# Altium project PCB_Project.PrjPcb
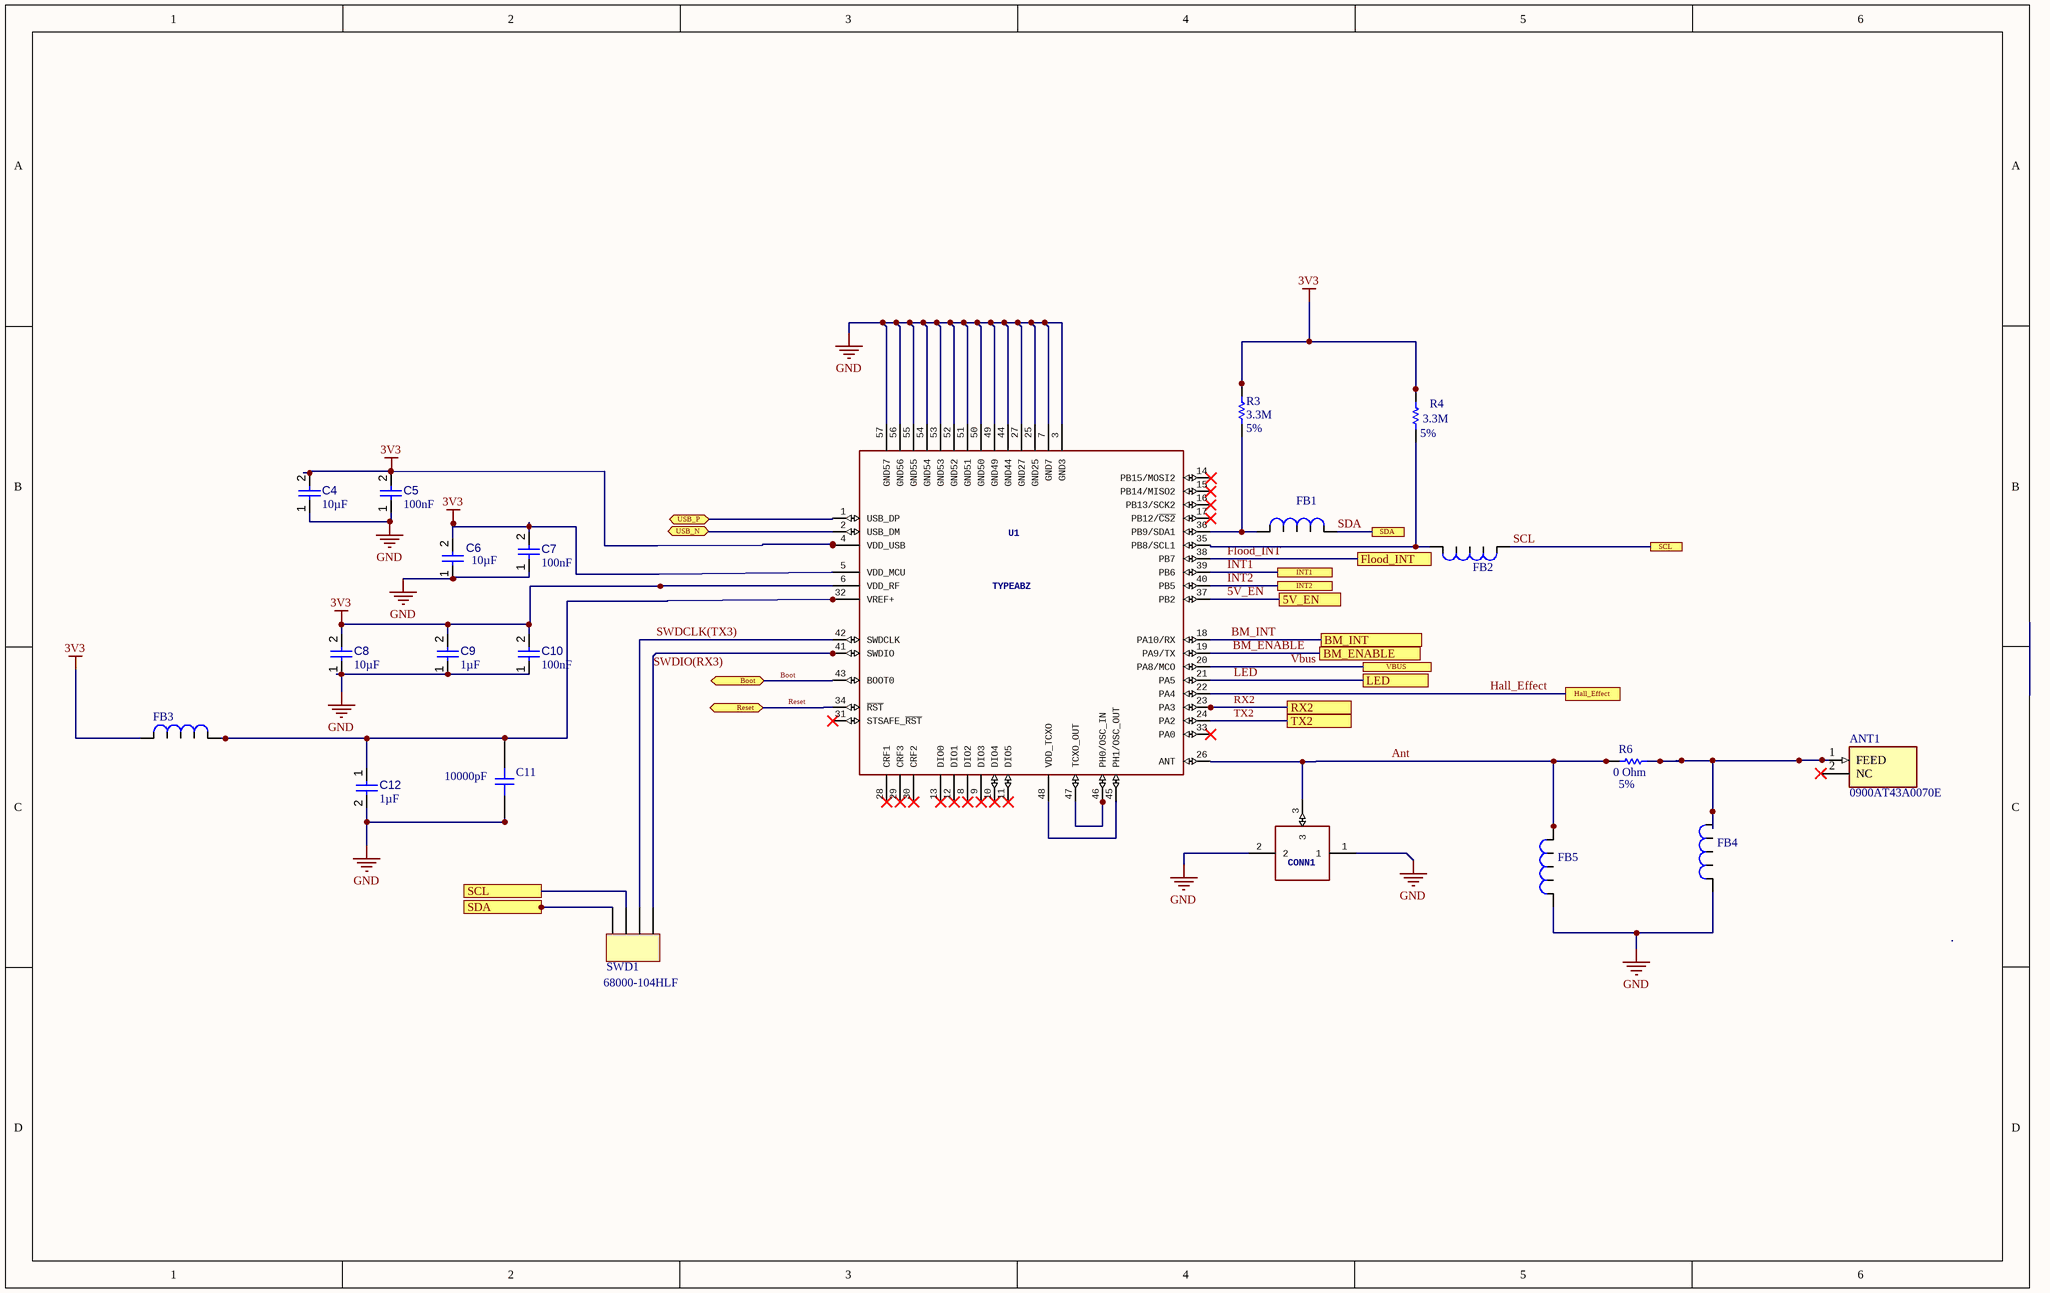
[diagram p0: [1]MCU.SchDoc]
8 sheets, 58 parts. Net scope: flat (ports and power ports of the same name join across sheets).
Board file: PCB_PROJECT.PcbDoc
Sheets:
  [1]MCU.SchDoc
  [2]Battery.SchDoc
  [3]USB.SchDoc
  [4]Button.SchDoc
  [5] Sensors.SchDoc
  [6]3-axis-accelerometer.SchDoc
  [7]Halleffec.SchDoc
  [8]O2-Flood.SchDoc

## Sheet [1]MCU.SchDoc
size B

### Parts
ANT1  0900AT43A0070E  [ANTC7020X90N]
C4  value 10µF  [CAPC0603(1608)100_L]  (hidden comment: Capacitor 10µF +/-20% 10V 0603)
C5  value 100nF  [CAPC1608X90X40ML10T20]  (hidden comment: Capacitor 100 nF +/-10% 50 V 0603)
C6  value 10µF  [CAPC0603(1608)100_L]  (hidden comment: Capacitor 10µF +/-20% 10V 0603)
C7  value 100nF  [CAPC1608X90X40ML10T20]  (hidden comment: Capacitor 100 nF +/-10% 50 V 0603)
C8  value 10µF  [CAPC0603(1608)100_L]  (hidden comment: Capacitor 10µF +/-20% 10V 0603)
C9  value 1µF  [CAPC1608X90X40ML10T20]  (hidden comment: Capacitor 1 uF +/- 10% 25 V 0603)
C10  value 100nF  [CAPC1608X90X40ML10T20]  (hidden comment: Capacitor 100 nF +/-10% 50 V 0603)
C11  10000PF  [CAPC0603]
C12  value 1µF  [CAPC1608X90X40ML10T20]  (hidden comment: Capacitor 1 uF +/- 10% 25 V 0603)
CONN1  U.FL-R-SMT-1  [U.FL-R-SMT-1]  (value not drawn)
FB1  BLM18AG102SN1D  [Ferrite Bead]  (value not drawn)
FB2  BLM18AG102SN1D  [Ferrite Bead]  (value not drawn)
FB3  BLM18AG102SN1D  [Ferrite Bead]  (value not drawn)
FB4  BLM18AG102SN1D  [Ferrite Bead]  (value not drawn)
FB5  BLM18AG102SN1D  [Ferrite Bead]  (value not drawn)
R3  value 3.3M  Tolerance: 5%  [RES 0603]  (hidden comment: RES 3.3M 5% 0.1W [0603])
R4  value 3.3M  Tolerance: 5%  [RES 0603]  (hidden comment: RES 3.3M 5% 0.1W [0603])
R6  value 0 Ohm  Tolerance: 5%  [RES 0603]  (hidden comment: RES 0 Ohm 5% 0.1W [0603])
SWD1  68000-104HLF  [4POS_HEADER]
U1  TYPEABZ  [CMWX1ZZABZ]

### Ports
5V_EN, BM_ENABLE, BM_INT, Boot (bidir), Flood_INT, Hall_Effect, INT1, INT2, LED, Reset (bidir), RX2, SCL, SDA, TX2, USB_N (bidir), USB_P (bidir), VBUS

### Nets
3V3: C4.2 C5.2 C6.2 C7.2 C8.2 C9.2 C10.2 FB3.2 R3.2 R4.2 U1.4(VDD_USB) U1.5(VDD_MCU) U1.6(VDD_RF)
GND: C4.1 C5.1 C6.1 C7.1 C8.1 C9.1 C10.1 C11.1 C12.2 CONN1.1 CONN1.2 FB4.2 FB5.2 U1.3(GND3) U1.7(GND7) U1.25(GND25) U1.27(GND27) U1.44(GND44) U1.49(GND49) U1.50(GND50) U1.51(GND51) U1.52(GND52) U1.53(GND53) U1.54(GND54) U1.55(GND55) U1.56(GND56) U1.57(GND57)
5V_EN: U1.37(PB2) ; port 5V_EN
Ant: CONN1.3 FB5.1 R6.1 U1.26(ANT)
BM_ENABLE: U1.19(PA9/TX) ; port BM_ENABLE
BM_INT: U1.18(PA10/RX) ; port BM_INT
Boot: U1.43(BOOT0) ; port Boot
Flood_INT: U1.38(PB7) ; port Flood_INT
Hall_Effect: U1.22(PA4) ; port Hall_Effect
INT1: U1.39(PB6) ; port INT1
INT2: U1.40(PB5) ; port INT2
LED: U1.21(PA5) ; port LED
Reset: U1.34(~{RST}) ; port Reset
RX2: U1.23(PA3) ; port RX2
SCL: FB2.2 SWD1.2 ; port SCL
SDA: FB1.2 SWD1.1 ; port SDA
SWDCLK(TX3): SWD1.3 U1.42(SWDCLK)
SWDIO(RX3): SWD1.4 U1.41(SWDIO)
TX2: U1.24(PA2) ; port TX2
USB_N: U1.2(USB_DM) ; port USB_N
USB_P: U1.1(USB_DP) ; port USB_P
Vbus: U1.20(PA8/MCO) ; port VBUS
NetANT1_1: ANT1.1(FEED) FB4.1 R6.2
NetC11_2: C11.2 C12.1 FB3.1 U1.32(VREF+)
NetFB1_1: FB1.1 R3.1 U1.36(PB9/SDA1)
NetFB2_1: FB2.1 R4.1 U1.35(PB8/SCL1)
NetU1_45: U1.45(PH1/OSC_OUT) U1.48(VDD_TCXO)
NetU1_46: U1.46(PH0/OSC_IN) U1.47(TCXO_OUT)

Not connected (* = marked no-connect by the designer): ANT1 2(NC); U1 8(DIO2)* 9(DIO3)* 10(DIO4)* 11(DIO5)* 12(DIO1)* 13(DIO0)* 14(PB15/MOSI2) 15(PB14/MISO2)* 16(PB13/SCK2)* 17(PB12/~{CS2})* 28(CRF1)* 29(CRF3)* 30(CRF2)* 31(STSAFE_~{RST})* 33(PA0)*

### Notes on the sheet
- Title
- Size:
- Date:
- A3
- Number:
- Time:
- Revision:
- Sheet
- of
- File:

### Library data of the parts
ANT1 = 0900AT43A0070E: Antenna; Manufacturer_Name: JOHANSON TECHNOLOGY; Datasheet Link: https://www.johansontechnology.com/datasheets/0900AT43A0070/0900AT43A0070.pdf; Height: 0.9mm; Manufacturer_Part_Number: 0900AT43A0070E
C4 C6 C8 = CMP-001-00075-2: Chip Capacitor, 10µF +/-20%, 10V, 0603, Thickness 1 mm; Tolerance: 10%; Mounting Technology: SMT; Pins: 2; Min Operating Temperature: -55°C; Case/Package: 0402; Max Operating Temperature: 85°C; Voltage Rating: 10V
C5 C7 C10 = CMP-001-00017-4: Chip Capacitor, 100 nF, +/- 10%, 50 V, 0603 (1608 Metric); Capacitor Type: Ceramic; Voltage Rating: 50V; RoHS Compliant: True; Max Operating Temperature: 125°C; Pins: 2; Mounting Technology: SM; Min Operating Temperature: -55°C; Tolerance: 10%; Case/Package: 0603
C9 C12 = CMP-001-00005-4: Chip Capacitor, 1 uF, +/- 10%, 25 V, 0603 (1608 Metric); Voltage Rating: 25V; Capacitor Type: Ceramic; Min Operating Temperature: -55°C; Tolerance: 10%; Max Operating Temperature: 125°C; Case/Package: 0603; RoHS Compliant: True; Mounting Technology: SM; Pins: 2
C11 = GRM188R71H103KA01D: CAP CER 10000PF 50V X7R 0603; Manufacturer: Murata Electronics North America; Tolerance: ±10%; Supplier 1: Digi-Key; Manufacturer Part Number: GRM188R71H103KA01D; RoHS: RoHS Compliant; Category: Capacitors; Stock 1: 5417714; Pricing 1: 1=0.14, 10=0.031, 100=0.0135, 500=0.00966, 1000=0.00758 (CAD); Packaging: Cut Tape (CT); Part Status: Active; Capacitance: 10000pF; Voltage - Rated: 50V; Temperature Coefficient: X7R; Operating Temperature: -55°C ~ 125°C; Features: -; Ratings: -; Applications: General Purpose; Mounting Type: Surface Mount, MLCC; Package / Case: 0603 (1608 Metric); Size / Dimension: 0.063" L x 0.031" W (1.60mm x 0.80mm); Height - Seated (Max): -; Thickness (Max): 0.035" (0.90mm); Lead Spacing: -; Lead Style: -; ComponentLink1URL: http://www.murata.com/~/media/webrenewal/support/library/catalog/products/capacitor/mlcc/c02e.ashx; ComponentLink1Description: http://www.murata.com/~/media/webrenewal/support/library/catalog/products/capacitor/mlcc/c02e.ashx; Supplier Part Number 1: 490-1512-1-ND
CONN1 = U.FL-R-SMT-1: GateName_1: G$1; SymbolName_1: U.FL-R-SMT-1; LibraryName: Kris; DeviceSetName: U.FL-R-SMT-1
FB1-FB5 = Ferrite Bead: Ferrite Bead 1KOhm @100MHz; Datasheet: https://www.murata.com/en-us/products/productdata/8796738650142/ENFA0003.pdf?src-supplier=Digi-Key; Supplier 1: Mouser; Supplier Part Number 1: 81-BLM11A102S; PN: BLM18AG102SN1D
R3 R4 = RES 3.3M 1% 0.1W [0603]: PN: CRCW06033M30FKEA; Supplier 1: Digi-Key; Supplier Part Number 1: 541-3.30MHCT-ND
R6 = RES 0 Ohm [0603]: PN: ERJ-3GEY0R00V; Supplier 1: Mouser; Supplier Part Number 1: 667-ERJ-3GEY0R00V; Datasheet: http://industrial.panasonic.com/cdbs/www-data/pdf/RDA0000/AOA0000C301.pdf?src-supplier=Farnell
SWD1 = 68000-104HLF: 4 Positions Header, Unshrouded Connector 0.100" (2.54mm) Through Hole Gold or Gold, GXT™; Manufacturer 1: Amphenol FCI; Number of Positions: 4; Gender: Male; Connector Type: Male Pin; Voltage Rating: 1.5kV; Current Rating: 3A; Insulation Resistance: 5GR; Mating Post Length: 5.84mm; Mount: Through Hole; Colour: Black; Housing Colour: Black; Housing Material: Thermoplastic; Contact Plating: Nickel,Gold,GXT; Contact Material: Bronze; Min Operating Temperature: -65°C; Max Operating Temperature: 125°C; Number of Rows: 1; Packaging: Bulk; Package Quantity: 100; Termination: Solder; Number of Contacts: 4; Orientation: Straight; Max Voltage Rating (AC): 1.5kV; Contact Gender: Male; Length: 10.16mm; Pitch: 2.54mm; Depth: 2.41mm; Termination Post Length: 2.41mm; Contact Mating Length: 0.23inch; Radiation Hardening: No; REACH SVHC: No SVHC; Flammability Rating: UL94 V-0; ComponentLink1URL: https://datasheet.ciiva.com/16726/68000-16726213.pdf; ComponentLink1Description: https://datasheet.ciiva.com/16726/68000-16726213.pdf; ComponentLink2URL: https://datasheet.ciiva.com/10149/68000-10149830.pdf; ComponentLink2Description: https://datasheet.ciiva.com/10149/68000-10149830.pdf; ComponentLink3URL: https://datasheet.ciiva.com/46395/1914865-46395854.pdf; ComponentLink3Description: https://datasheet.ciiva.com/46395/1914865-46395854.pdf; ComponentLink4URL: https://datasheet.ciiva.com/728/68000-728879.pdf; ComponentLink4Description: https://datasheet.ciiva.com/728/68000-728879.pdf; Description 1: 4 Positions Header, Unshrouded Connector 0.100" (2.54mm) Through Hole Gold or Gold, GXT™; Manufacturer Part Number 1: 68000-104HLF; Pricing 1: 1=0.33, 10=0.316, 100=0.2212, 500=0.18964, 1000=0.15803, 5000=0.13545, 10000=0.12642 (USD); Stock 1: 10785; Supplier 1: Digi-Key; Supplier Part Number 1: 609-3248-ND
U1 = TYPEABZ: CMWX1ZZABZ-078; GateName_1: G$1; SymbolName_1: TYPEABZ; DeviceSetName: TYPEABZ

## Sheet [2]Battery.SchDoc
size B
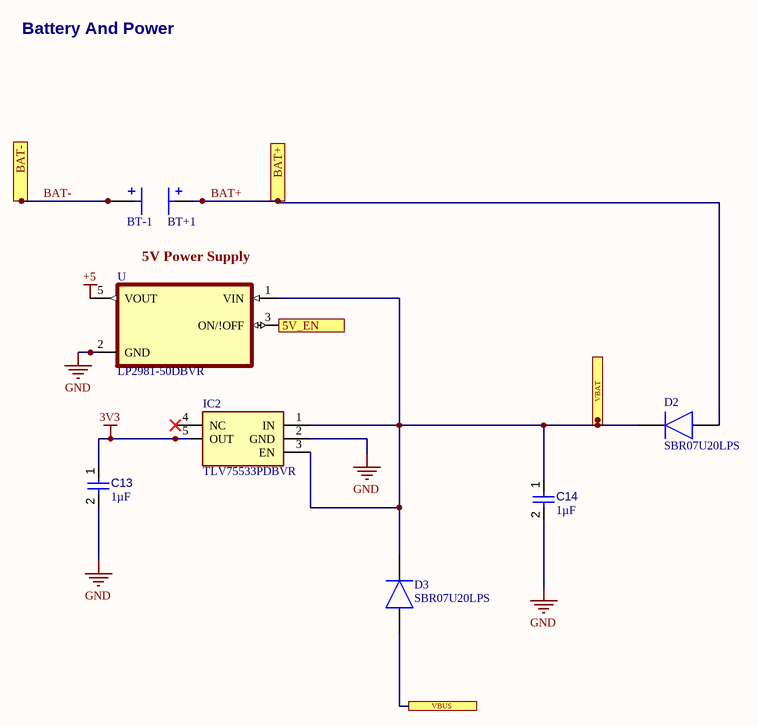
[diagram p1: [2]Battery.SchDoc]

### Parts
BT+1  BATTERY CONTACT CLIP A/AA PC PIN  [BAT_BK-82]  (value not drawn)
BT-1  BATTERY CONTACT CLIP A/AA PC PIN  [BAT_BK-82]  (value not drawn)
C13  value 1µF  [CAPC1608X90X40ML10T20]  (hidden comment: Capacitor 1 uF +/- 10% 25 V 0603)
C14  value 1µF  [CAPC1608X90X40ML10T20]  (hidden comment: Capacitor 1 uF +/- 10% 25 V 0603)
D2  SBR07U20LPS  [CDBQR70HF]
D3  SBR07U20LPS  [CDBQR70HF]
IC2  TLV75533PDBVR  [SOT95P280X145-5N]
U  LP2981-50DBVR  [SOT95P280X145-5N]

### Ports
5V_EN, BAT+, BAT-, VBAT, VBUS

### Nets
3V3: C13.1 IC2.5(OUT)
+5: U.5(VOUT)
GND: C13.2 C14.2 IC2.2(GND) U.2(GND)
5V_EN: U.3(ON/!OFF) ; port 5V_EN
BAT+: BT+1.S1(POS) BT+1.S2(POS) D2.2(A) ; port BAT+
BAT-: BT-1.S1(POS) BT-1.S2(POS) ; port BAT-
Vbus: D3.2(A) ; port VBUS
NetC14_1: C14.1 D2.1(K) D3.1(K) IC2.1(IN) IC2.3(EN) U.1(VIN) ; port VBAT

Not connected (* = marked no-connect by the designer): IC2 4(NC)*

### Notes on the sheet
- Battery And Power
- 5V Power Supply
- Title
- Size:
- Date:
- A3
- Number:
- Time:
- Revision:
- Sheet
- of
- File:

### Library data of the parts
BT+1 BT-1 = BK-82: Battery Contact Clip A, AA 1 Cell PC Pin; MF PN: 92 -Keystone Electronics; DK PN: 36-92-ND; Value: *; Availability: Unavailable; Package: None; Price: None
C13 C14 = CMP-001-00005-4: as C9 on sheet [1]MCU; Min Operating Temperature: -55°C; Tolerance: 10%; Max Operating Temperature: 125°C; Case/Package: 0603; RoHS Compliant: True; Mounting Technology: SM; Pins: 2
D2 D3 = CDSQR4148-HF_1: Diode; Manufacturer_Name: Comchip Technology; Datasheet Link: http://www.comchiptech.com/admin/files/product/CDSQR4148-HF-RevC213424.pdf; Height: 0mm; Manufacturer_Part_Number: CDSQR4148-HF; Arrow Part Number: CDSQR4148-HF; Arrow Price/Stock: https://www.arrow.com/en/products/cdsqr4148-hf/comchip-technology; Mouser Part Number: 750-CDSQR4148-HF; Mouser Price/Stock: https://www.mouser.co.uk/ProductDetail/Comchip-Technology/CDSQR4148-HF?qs=2qJf6qQ4IOKNV97fk6Xvow%3D%3D; ComponentLink1Description: SBR07U20LPS; ComponentLink1URL: https://www.diodes.com/assets/Datasheets/SBR07U20LPS.pdf
IC2 = TLV75533PDBVR: Integrated Circuit; Manufacturer_Name: Texas Instruments; Datasheet Link: http://www.ti.com/lit/gpn/tlv755p; Height: 1.45mm; Manufacturer_Part_Number: TLV75533PDBVR; Mouser Part Number: 595-TLV75533PDBVR; Mouser Price/Stock: https://www.mouser.co.uk/ProductDetail/Texas-Instruments/TLV75533PDBVR?qs=55YtniHzbhAKEwqeO2xJXQ%3D%3D; Arrow Part Number: TLV75533PDBVR; Arrow Price/Stock: https://www.arrow.com/en/products/tlv75533pdbvr/texas-instruments
U = LP2981-50DBVR: 100-mA, 16-V, low-dropout voltage regulator with enable 5-SOT-23 -40 to 125; MF: Texas Instruments; Package: SOT-23-5 Texas Instruments; SnapEDA_Link: https://www.snapeda.com/parts/LP2981-50DBVR/Texas%20Instruments/view-part/472200/?ref=snap; DigiKey-Purchase-URL: https://snapeda.com/shop?store=DigiKey&id=472200; MP: LP2981-50DBVR; Value: *; Arrow_Electronics-Purchase-URL: https://snapeda.com/shop?store=Arrow+Electronics&id=472200; Availability: Unavailable; Texas_Instruments-Purchase-URL: https://snapeda.com/shop?store=Texas+Instruments&id=472200; Price: None; Mouser-Purchase-URL: https://snapeda.com/shop?store=Mouser&id=472200

## Sheet [3]USB.SchDoc
size B
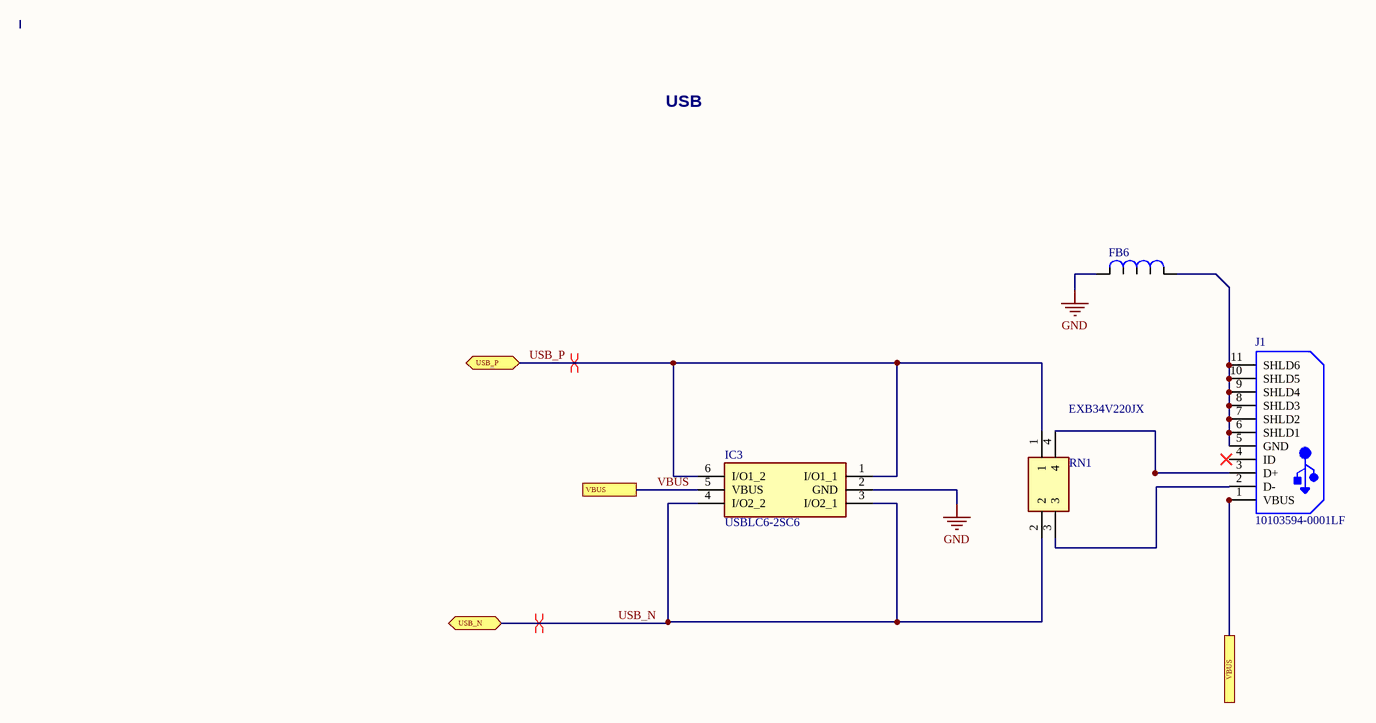
[diagram p2: [3]USB.SchDoc]

### Parts
FB6  BLM18AG102SN1D  [Ferrite Bead]  (value not drawn)
IC3  USBLC6-2SC6  [SOT95P280X145-6N]
J1  10103594-0001LF  [FCI-10103594-0001LF_V]
RN1  EXB34V220JX  [EXB34V103JV]

### Ports
USB_N (bidir), USB_P (bidir), VBUS

### Nets
GND: FB6.2 IC3.2(GND)
USB_N: IC3.3(I/O2_1) IC3.4(I/O2_2) RN1.2 ; port USB_N
USB_P: IC3.1(I/O1_1) IC3.6(I/O1_2) RN1.1 ; port USB_P
Vbus: IC3.5(VBUS) J1.1(VBUS) ; port VBUS
NetFB6_1: FB6.1 J1.5(GND) J1.6(SHLD1) J1.7(SHLD2) J1.8(SHLD3) J1.9(SHLD4) J1.10(SHLD5) J1.11(SHLD6)
NetJ1_2: J1.2(D-) RN1.3
NetJ1_3: J1.3(D+) RN1.4

Not connected (* = marked no-connect by the designer): J1 4(ID)

### Layout directives
differential pair; differential pair class USBDiffPair: USB_N, USB_P

### Notes on the sheet
- USB
- 8
- 7
- 6
- 5
- 4
- 3
- DWG. NO.
- REV.
- SHT.
- REVISION
- 2
- DESCRIPTION
- DATE
- 1
- APPROVED
- THIS DOCUMENT AND THE DATA DISCLOSED HEREIN OR HEREWITH IS THE PROPERTY OF ALTIUM LIMITED AND MAY BE FREELY DISTRIBUTED IN WHOLE. NO RIGHTS ARE RESERVED OR EXPRESS OR IMPLIED WARANTEE GIVEN.
- F
- E
- D
- C
- B
- A
- SCALE:
- A3
- SIZE
- CAGE CODE
- FILE NAME
- DWG NO.
- SHEET
- OF
- REV

### Library data of the parts
FB6 = Ferrite Bead: Ferrite Bead 1KOhm @100MHz; Datasheet: https://www.murata.com/en-us/products/productdata/8796738650142/ENFA0003.pdf?src-supplier=Digi-Key; Supplier 1: Mouser; Supplier Part Number 1: 81-BLM11A102S; PN: BLM18AG102SN1D
IC3 = USBLC6-2SC6: Integrated Circuit; Manufacturer_Name: STMicroelectronics; Datasheet Link: http://www.st.com/st-web-ui/static/active/en/resource/technical/document/datasheet/CD00050750.pdf; Height: 1.45mm; Manufacturer_Part_Number: USBLC6-2SC6; Mouser Part Number: 511-USBLC6-2SC6; Mouser Price/Stock: https://www.mouser.co.uk/ProductDetail/STMicroelectronics/USBLC6-2SC6/?qs=po45yt2pPpu%2FhNIlwQdTlg%3D%3D; Arrow Part Number: USBLC6-2SC6; Arrow Price/Stock: https://www.arrow.com/en/products/usblc6-2sc6/stmicroelectronics
J1 = CMP-002-00038-1: Micro USB 2.0 B Receptacle, 5 Position, Height 3.24 mm, -55 to 85 degC, RoHS, Tape and Reel; Manufacturer: FCI Electronics; Voltage Rating: 100V; Gender: Female; Current Rating: 1.8A; Min Operating Temperature: -55°C; Pins: 5; Contact Plating: Gold; Package Description: 5-Pin Surface Mount Device, Body 8.04 x 5.62 mm; RoHS Compliant: True; Lead Pitch: 0.65mm; Packaging: TapeandReel; Case/Package: FCI-10103594-0001LF; Manufacturer URL: http://portal.fciconnect.com/; Mounting Technology: SM; Datasheet Version: Rev. A, 06/2010; Connector Type: USB; Contact Material: Copper; Datasheet URL: http://portal.fciconnect.com/Comergent//fci/drawing/10103594.pdf; Max Operating Temperature: 85°C; Package Quantity: 1500; Package Reference: FCI-10103594-0001LF
RN1 = EXB34V330JV: Resistor Network; Manufacturer_Name: Panasonic; Datasheet Link: https://industrial.panasonic.com/cdbs/www-data/pdf/AOC0000/AOC0000C14.pdf; Height: 0.5mm; Manufacturer_Part_Number: EXB34V330JV; ComponentLink1Description: EXB24/34V; ComponentLink1URL: https://www.mouser.ca/datasheet/2/315/AOC0000C14-1108062.pdf

## Sheet [4]Button.SchDoc
size B
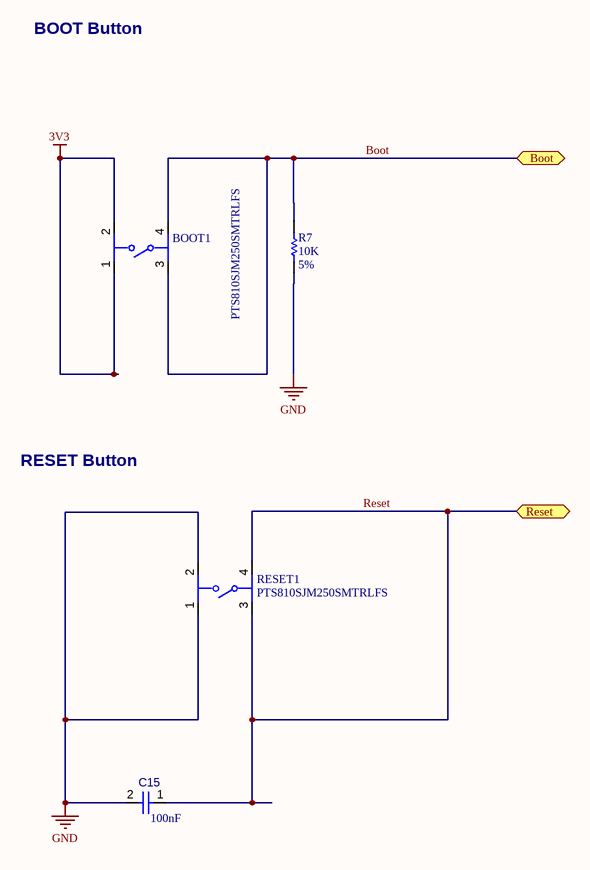
[diagram p3: [4]Button.SchDoc]

### Parts
BOOT1  PTS810SJM250SMTRLFS  [FP-PTS810SJM250SMTRLFS-MFG]
C15  value 100nF  [CAPC1608X90X40ML10T20]  (hidden comment: Capacitor 100 nF +/-10% 50 V 0603)
R7  value 10K  Tolerance: 5%  [RES 0603]  (hidden comment: RES 10K 5% 0.1W [0603])
RESET1  PTS810SJM250SMTRLFS  [FP-PTS810SJM250SMTRLFS-MFG]

### Ports
Boot (bidir), Reset (bidir)

### Nets
3V3: BOOT1.1 BOOT1.2
GND: C15.2 R7.1 RESET1.1 RESET1.2
Boot: BOOT1.3 BOOT1.4 R7.2 ; port Boot
Reset: C15.1 RESET1.3 RESET1.4 ; port Reset

### Notes on the sheet
- BOOT Button
- RESET Button
- 8
- 7
- 6
- 5
- 4
- 3
- DWG. NO.
- REV.
- SHT.
- REVISION
- 2
- DESCRIPTION
- DATE
- 1
- APPROVED
- THIS DOCUMENT AND THE DATA DISCLOSED HEREIN OR HEREWITH IS THE PROPERTY OF ALTIUM LIMITED AND MAY BE FREELY DISTRIBUTED IN WHOLE. NO RIGHTS ARE RESERVED OR EXPRESS OR IMPLIED WARANTEE GIVEN.
- F
- E
- D
- C
- B
- A
- SCALE:
- A3
- SIZE
- CAGE CODE
- FILE NAME
- DWG NO.
- SHEET
- OF
- REV

### Library data of the parts
BOOT1 RESET1 = Button: SWITCH TACTILE SPST-NO 0.05A 16V; Manufacturer: C&K Components; Throw Configuration: SPST; Contact Resistance: 500mΩ; Electromechanical Life: 150000Cycles; Operating Force: 160gf; Contact Current Rating: 50mA; Temperature: -40°C to +85°C; Device Class L2: Switches; Digikey Description: SWITCH TACTILE SPST-NO 0.05A 16V; Automotive: No; Height: 2.7mm; ComponentLink2Description: Datasheet; Temperature Range Low: -40°C; Device Class L1: Electromechanical; Mouser Description: Switch Tactile N.O. SPST Button J-Bend 0.05A 16VDC 150000Cycles 1.57N SMD T/R; Octopart: https://octopart.com/pts810+sjm+250+smtr+lfs-c%26k+components-29687929; Lead Free: Yes; Voltage Rating Dc: 16V; Temperature Range High: +85°C; Package: PTS810SJM250SMTRLFS; Manufacturer Part Number: PTS810SJM250SMTRLFS; ComponentLink2URL: https://www.ckswitches.com/media/1476/pts810.pdf; Category: Switch; RoHS: TRUE; Device Class L3: Tactile Switches
C15 = CMP-001-00017-4: as C5 on sheet [1]MCU; RoHS Compliant: True; Max Operating Temperature: 125°C; Pins: 2; Mounting Technology: SM; Min Operating Temperature: -55°C; Tolerance: 10%; Case/Package: 0603
R7 = RES 10K 5% 0.1W [0603]: PN: CR0603-JW-103ELF; Supplier 1: Newark; Supplier Part Number 1: 84W7243

## Sheet [5] Sensors.SchDoc
size B
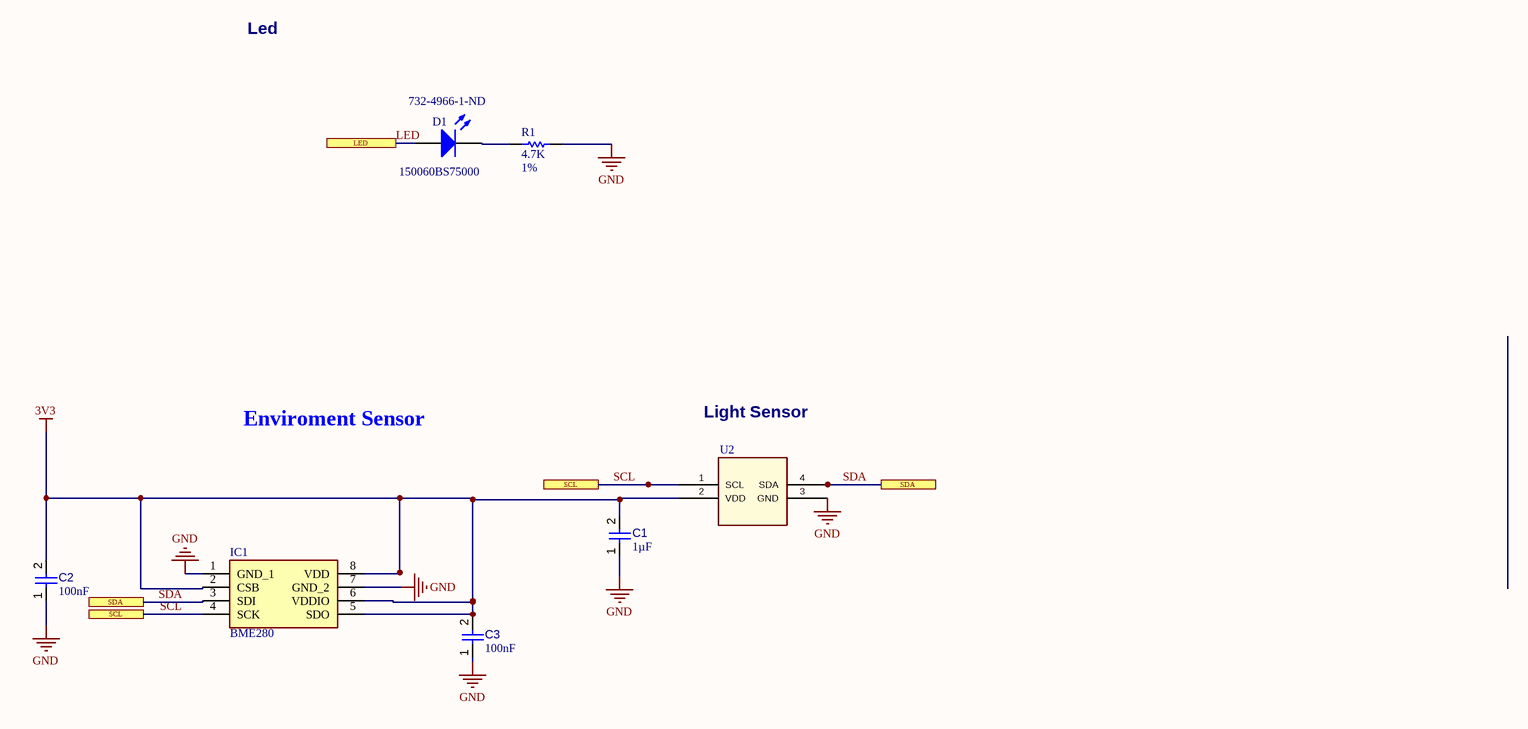
[diagram p4: [5] Sensors.SchDoc]

### Parts
C1  value 1µF  [CAPC1608X90X40ML10T20]  (hidden comment: Capacitor 1 uF +/- 10% 25 V 0603)
C2  value 100nF  [CAPC1608X90X40ML10T20]  (hidden comment: Capacitor 100 nF +/-10% 50 V 0603)
C3  value 100nF  [CAPC1608X90X40ML10T20]  (hidden comment: Capacitor 100 nF +/-10% 50 V 0603)
D1  Supplier Part Number 1: 732-4966-1-ND  PN: 150060BS75000  [LED BLUE CLEAR [0603]]  (hidden comment: LED)
IC1  BME280  [Sensor housing 8-pin LGA]
R1  Resistance: 4.7K  Tolerance: 1%  [RES 0603]  (hidden comment: RES 4.7K 1% 0.1W [0603])
U2  VEML7700-TR  [Ambient Light Sensor with I2C]  (value not drawn)

### Ports
LED, SCL, SDA

### Nets
3V3: C1.2 C2.2 C3.2 IC1.2(CSB) IC1.5(SDO) IC1.6(VDDIO) IC1.8(VDD) U2.2(VDD)
GND: C1.1 C2.1 C3.1 IC1.1(GND_1) IC1.7(GND_2) R1.2 U2.3(GND)
LED: D1.2 ; port LED
SCL: IC1.4(SCK) U2.1(SCL) ; port SCL
SDA: IC1.3(SDI) U2.4(SDA) ; port SDA
NetD1_1: D1.1 R1.1

### Notes on the sheet
- Led
- Enviroment Sensor
- Light Sensor

### Library data of the parts
C1 = CMP-001-00005-4: as C9 on sheet [1]MCU; Min Operating Temperature: -55°C; Tolerance: 10%; Max Operating Temperature: 125°C; Case/Package: 0603; RoHS Compliant: True; Mounting Technology: SM; Pins: 2
C2 C3 = CMP-001-00017-4: as C5 on sheet [1]MCU; RoHS Compliant: True; Max Operating Temperature: 125°C; Pins: 2; Mounting Technology: SM; Min Operating Temperature: -55°C; Tolerance: 10%; Case/Package: 0603
D1 = LED BLUE CLEAR 0603 SMD: Supplier 1: Digi-Key; Datasheet: https://katalog.we-online.de/led/datasheet/150060BS75000.pdf
IC1 = BME680: Integrated Circuit; Manufacturer_Name: Bosch Sensortec; Datasheet Link: https://ae-bst.resource.bosch.com/media/_tech/media/datasheets/BST-BME680-DS001-00.pdf; Manufacturer_Part_Number: BME680; Mouser Part Number: 262-BME680; Mouser Price/Stock: https://www.mouser.co.uk/ProductDetail/Bosch-Sensortec/BME680?qs=v271MhAjFHjo0yA%2FC4OnDQ%3D%3D; Arrow Part Number: BME680; Arrow Price/Stock: https://www.arrow.com/en/products/bme680/bosch
R1 = RES 4.7K 1% [0603]: PN: ERJ-3EKF4701V; Supplier 1: Digi-Key; Supplier Part Number 1: P4.70KHCT-ND
U2 = Ambient Light Sensor I2C: Ambient Light Sensor with I2C; Supplier 1: Digi-Key; Supplier Part Number 1: VEML7700CT-ND; Datasheet: https://media.digikey.com/pdf/Data%20Sheets/Vishay%20Semiconductors/VEML7700.pdf; PN: VEML7700-TR

## Sheet [6]3-axis-accelerometer.SchDoc
size B
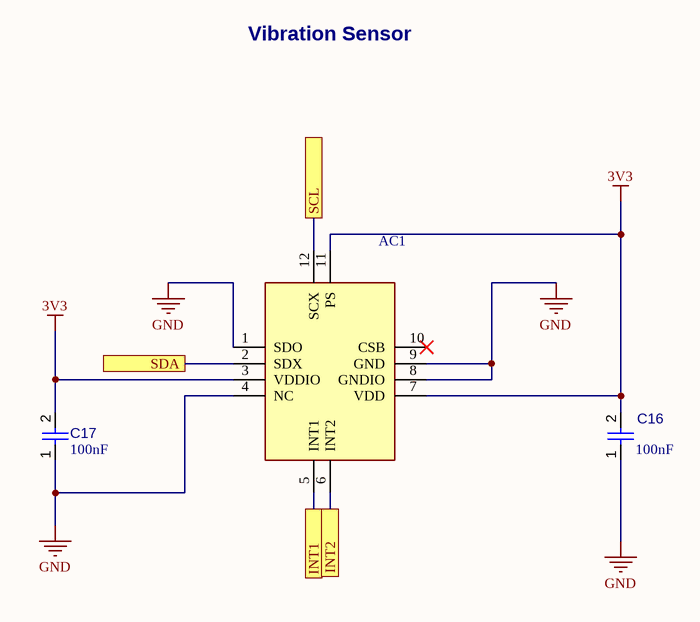
[diagram p5: [6]3-axis-accelerometer.SchDoc]

### Parts
AC1  BMA490L  [BMA280]  (value not drawn)
C16  value 100nF  [CAPC1608X90X40ML10T20]  (hidden comment: Capacitor 100 nF +/-10% 50 V 0603)
C17  value 100nF  [CAPC1608X90X40ML10T20]  (hidden comment: Capacitor 100 nF +/-10% 50 V 0603)

### Ports
INT1, INT2, SCL, SDA

### Nets
3V3: AC1.3(VDDIO) AC1.7(VDD) AC1.11(PS) C16.2 C17.2
GND: AC1.1(SDO) AC1.4(NC) AC1.8(GNDIO) AC1.9(GND) C16.1 C17.1
INT1: AC1.5(INT1) ; port INT1
INT2: AC1.6(INT2) ; port INT2
SCL: AC1.12(SCX) ; port SCL
SDA: AC1.2(SDX) ; port SDA

Not connected (* = marked no-connect by the designer): AC1 10(CSB)*

### Notes on the sheet
- Vibration Sensor

### Library data of the parts
AC1 = BMA280: BMA490L Accelerometer; Manufacturer_Name: Bosch Sensortec; Datasheet Link: https://ae-bst.resource.bosch.com/media/_tech/media/datasheets/BST-BMA280-DS000.pdf; Height: 1mm; Manufacturer_Part_Number: BMA280; Arrow Part Number: BMA280; Arrow Price/Stock: https://www.arrow.com/en/products/bma280/bosch; Mouser Part Number: 262-BMA280; Mouser Price/Stock: https://www.mouser.co.uk/ProductDetail/Bosch-Sensortec/BMA280?qs=d72FGnIDsgRcX8VH3KFYOw%3D%3D; ComponentLink1Description: docu; ComponentLink1URL: https://www.bosch-sensortec.com/media/boschsensortec/downloads/datasheets/bst-bma280-ds000.pdf
C16 C17 = CMP-001-00017-4: as C5 on sheet [1]MCU; RoHS Compliant: True; Max Operating Temperature: 125°C; Pins: 2; Mounting Technology: SM; Min Operating Temperature: -55°C; Tolerance: 10%; Case/Package: 0603

## Sheet [7]Halleffec.SchDoc
size B
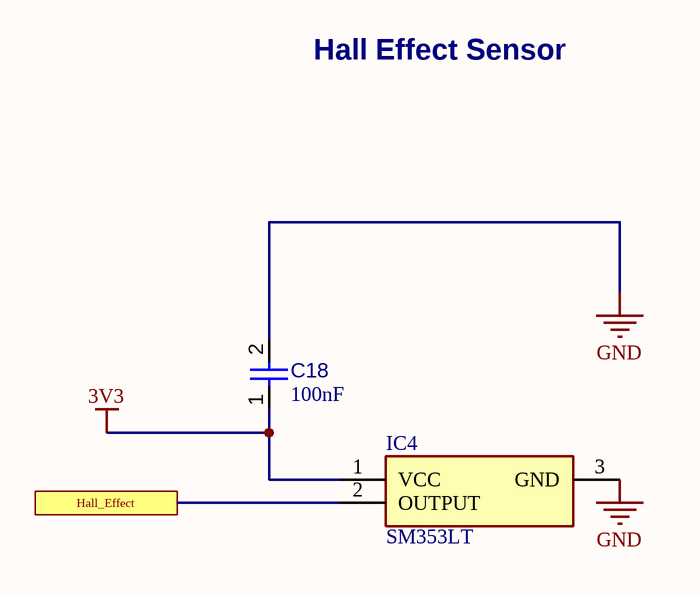
[diagram p6: [7]Halleffec.SchDoc]

### Parts
C18  value 100nF  [CAPC1608X90X40ML10T20]  (hidden comment: Capacitor 100 nF +/-10% 50 V 0603)
IC4  SM353LT  [SOT95P280X145-3N]

### Ports
Hall_Effect

### Nets
3V3: C18.1 IC4.1(VCC)
GND: C18.2 IC4.3(GND)
Hall_Effect: IC4.2(OUTPUT) ; port Hall_Effect

### Notes on the sheet
- Hall Effect Sensor

### Library data of the parts
C18 = CMP-001-00017-4: as C5 on sheet [1]MCU; RoHS Compliant: True; Max Operating Temperature: 125°C; Pins: 2; Mounting Technology: SM; Min Operating Temperature: -55°C; Tolerance: 10%; Case/Package: 0603
IC4 = SM353LT: Integrated Circuit; Manufacturer_Name: Honeywell; Datasheet Link: http://uk.rs-online.com/web/p/products/8252612; Height: 1.45mm; Manufacturer_Part_Number: SM353LT; Arrow Part Number: SM353LT; Arrow Price/Stock: https://www.arrow.com/en/products/sm353lt/honeywell; Mouser Part Number: 785-SM353LT; Mouser Price/Stock: https://www.mouser.co.uk/ProductDetail/Honeywell/SM353LT?qs=sJdZgDoFdSW3aINL1oUyuA%3D%3D; ComponentLink1Description: documentation; ComponentLink1URL: http://www.farnell.com/datasheets/2012450.pdf?_ga=2.245790722.741299232.1603476058-140605836.1598371586&_gac=1.141304070.1603476058.EAIaIQobChMItI734qXL7AIVmRatBh3JPwF_EAAYAiAAEgIk7PD_BwE

## Sheet [8]O2-Flood.SchDoc: Edge device Sensor Board
size B; Organization: Latium Group of Companies; Address1: 1312 10 St; Address2: Nisku, Alberta, Canada; Address3: T9E 8K2; Revision: 1.1; SheetNumber: 1; SheetTotal: 1
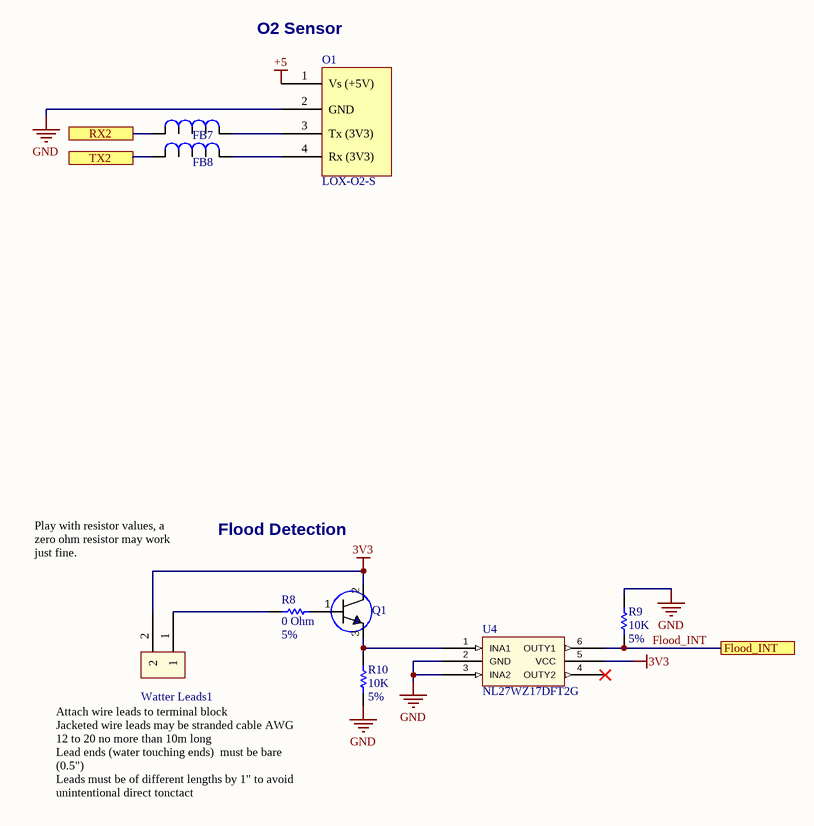
[diagram p7: [8]O2-Flood.SchDoc]

### Parts
FB7  BLM18AG102SN1D  [Ferrite Bead]  (value not drawn)
FB8  BLM18AG102SN1D  [Ferrite Bead]  (value not drawn)
O1  LOX-O2-S  [LuminOx O2 Sensors]
Q1  PNP General Purpose SMD  [SOT-89 (MPT3)]  (value not drawn)
R8  value 0 Ohm  Tolerance: 5%  [RES 0603]  (hidden comment: RES 0 Ohm 5% 0.1W [0603])
R9  value 10K  Tolerance: 5%  [RES 0603]  (hidden comment: RES 10K 5% 0.1W [0603])
R10  value 10K  Tolerance: 5%  [RES 0603]  (hidden comment: RES 10K 5% 0.1W [0603])
U4  PN: NL27WZ17DFT2G  [SC-88]  (hidden comment: Schmitt Trigger Buffer,  Dual, Non-Inverting)
Watter_Leads1  TRM BLCK 1x2  [TRM BLCK Pitch 5mm 2Pos]  (value not drawn)

### Ports
Flood_INT, RX2, TX2

### Nets
3V3: Q1.2(COLLECTOR) U4.5(VCC) Watter_Leads1.2
+5: O1.1(Vs_(+5V))
GND: O1.2(GND) R9.2 R10.1 U4.2(GND) U4.3(INA2)
Flood_INT: R9.1 U4.6(OUTY1) ; port Flood_INT
RX2: FB7.1 ; port RX2
TX2: FB8.1 ; port TX2
NetFB7_2: FB7.2 O1.3(Tx_(3V3))
NetFB8_2: FB8.2 O1.4(Rx_(3V3))
NetQ1_1: Q1.1(BASE) R8.2
NetQ1_3: Q1.3(EMITTER) R10.2 U4.1(INA1)
NetR8_1: R8.1 Watter_Leads1.1

Not connected (* = marked no-connect by the designer): U4 4(OUTY2)*

### Notes on the sheet
- (near O1) O2 Sensor
- Play with resistor values, a zero ohm resistor may work just fine.
- Flood Detection
- Attach wire leads to terminal block
  Jacketed wire leads may be stranded cable AWG  12 to 20 no more than 10m long
  Lead ends (water touching ends)  must be bare (0.5")
  Leads must be of different lengths by 1" to avoid unintentional direct tonctact
- Title
- Size:
- Date:
- Tabloid
- Number:
- Time:
- Revision:
- Sheet
- of
- File:

### Library data of the parts
FB7 FB8 = Ferrite Bead: Ferrite Bead 1KOhm @100MHz; Datasheet: https://www.murata.com/en-us/products/productdata/8796738650142/ENFA0003.pdf?src-supplier=Digi-Key; Supplier 1: Mouser; Supplier Part Number 1: 81-BLM11A102S; PN: BLM18AG102SN1D
Q1 = PNP General Purpose SMD: PN: DTDG14GPT100; Supplier 1: Digi-Key; Supplier Part Number 1: DTDG14GPT100CT-ND; Datasheet: http://rohmfs.rohm.com/en/products/databook/datasheet/discrete/transistor/digital/dtdg14gpt100-e.pdf; Datasheet2: http://rohmfs.rohm.com/en/techdata_basic/transistor/taping/MPT3_T100_taping.pdf
R8 = RES 0 Ohm [0603]: PN: ERJ-3GEY0R00V; Supplier 1: Mouser; Supplier Part Number 1: 667-ERJ-3GEY0R00V; Datasheet: http://industrial.panasonic.com/cdbs/www-data/pdf/RDA0000/AOA0000C301.pdf?src-supplier=Farnell
R9 R10 = RES 10K 5% 0.1W [0603]: PN: CR0603-JW-103ELF; Supplier 1: Newark; Supplier Part Number 1: 84W7243
U4 = IC BUFFER NON-INVERT 5.5V SC88: Supplier 1: Digi-Key; Supplier Part Number 1: NL27WZ16DFT2GOSCT-ND; Datasheet: https://www.onsemi.com/pub/Collateral/NL27WZ17-D.PDF
Watter_Leads1 = TRM BLCK 1x2: TM Pitch 5mm 2A Screw; Manufacturer: Würth Elektronik; PN: 691137710002; Supplier 1: Digi-Key; Supplier Part Number 1: 732-10955-ND; Datasheet: https://www.we-online.de/katalog/datasheet/691137710002.pdf
O1 = LOX-O2-S: Datasheet: https://www.sstsensing.com/wp-content/uploads/2019/07/DS0030rev14_LuminOx.pdf; URL: https://www.sstsensing.com/product/luminox-optical-oxygen-sensors-2/; Supplier: www.sstsensing.com; PN: LOX-O2-S

## Nets that join several sheets
3V3: [1]MCU (13 pins), [2]Battery (C13.1 IC2.5), [4]Button (BOOT1.1 BOOT1.2), [5] Sensors (8 pins), [6]3-axis-accelerometer (5 pins), [7]Halleffec (C18.1 IC4.1), [8]O2-Flood (Q1.2 U4.5 Watter_Leads1.2)
+5: [2]Battery (U.5), [8]O2-Flood (O1.1)
GND: [1]MCU (27 pins), [2]Battery (C13.2 C14.2 IC2.2 U.2), [3]USB (FB6.2 IC3.2), [4]Button (C15.2 R7.1 RESET1.1 RESET1.2), [5] Sensors (7 pins), [6]3-axis-accelerometer (6 pins), [7]Halleffec (C18.2 IC4.3), [8]O2-Flood (5 pins)
5V_EN: [1]MCU (U1.37), [2]Battery (U.3)
Boot: [1]MCU (U1.43), [4]Button (BOOT1.3 BOOT1.4 R7.2)
Flood_INT: [1]MCU (U1.38), [8]O2-Flood (R9.1 U4.6)
Hall_Effect: [1]MCU (U1.22), [7]Halleffec (IC4.2)
INT1: [1]MCU (U1.39), [6]3-axis-accelerometer (AC1.5)
INT2: [1]MCU (U1.40), [6]3-axis-accelerometer (AC1.6)
LED: [1]MCU (U1.21), [5] Sensors (D1.2)
Reset: [1]MCU (U1.34), [4]Button (C15.1 RESET1.3 RESET1.4)
RX2: [1]MCU (U1.23), [8]O2-Flood (FB7.1)
SCL: [1]MCU (FB2.2 SWD1.2), [5] Sensors (IC1.4 U2.1), [6]3-axis-accelerometer (AC1.12)
SDA: [1]MCU (FB1.2 SWD1.1), [5] Sensors (IC1.3 U2.4), [6]3-axis-accelerometer (AC1.2)
TX2: [1]MCU (U1.24), [8]O2-Flood (FB8.1)
USB_N: [1]MCU (U1.2), [3]USB (IC3.3 IC3.4 RN1.2)
USB_P: [1]MCU (U1.1), [3]USB (IC3.1 IC3.6 RN1.1)
Vbus: [1]MCU (U1.20), [2]Battery (D3.2), [3]USB (IC3.5 J1.1)

## Assembly variants
Variant of PCB_Project: not fitted FB5 FB6 SWD2